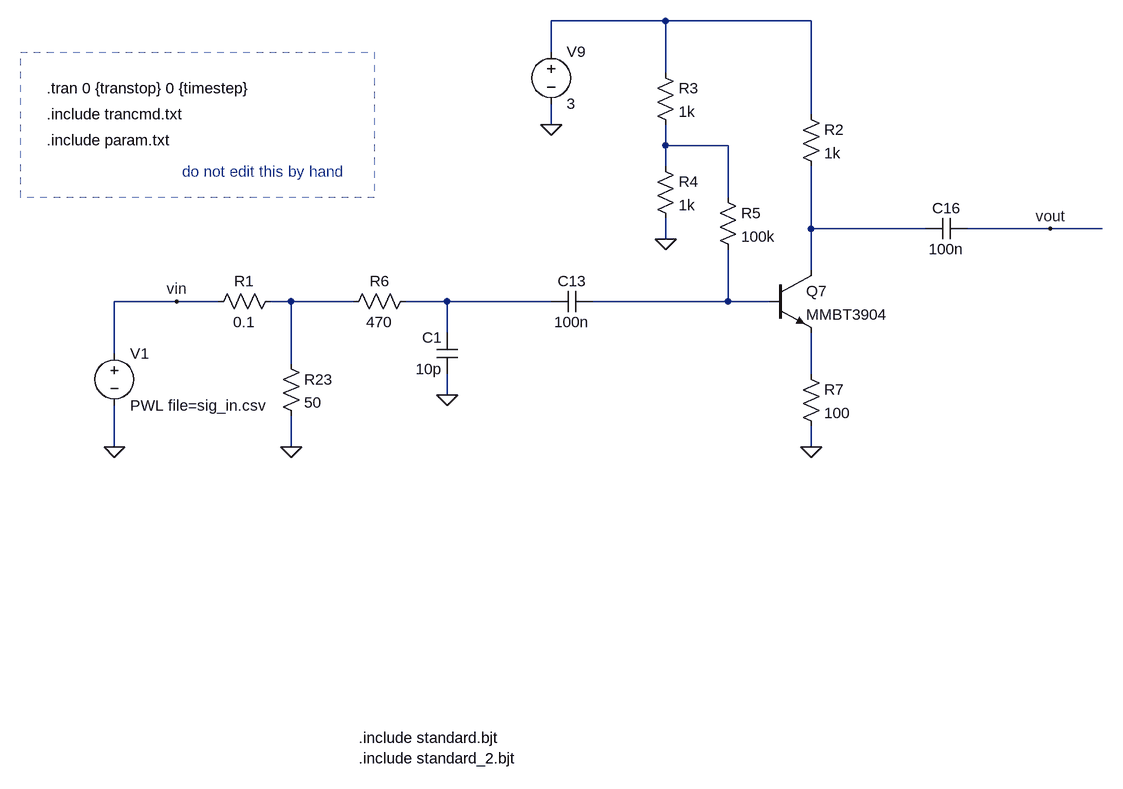
[diagram p0: schematic vca_01.asc]
vca_01.asc, the LTspice schematic file:
Version 4
SHEET 1 25452 10420
WIRE 18768 5776 18592 5776
WIRE 18992 5776 18768 5776
WIRE 18592 5824 18592 5776
WIRE 18768 5856 18768 5776
WIRE 18992 5920 18992 5776
WIRE 18592 5936 18592 5904
WIRE 18768 5968 18768 5936
WIRE 18864 5968 18768 5968
WIRE 18768 6000 18768 5968
WIRE 18864 6048 18864 5968
WIRE 18992 6096 18992 6000
WIRE 19168 6096 18992 6096
WIRE 19360 6096 19232 6096
WIRE 19440 6096 19360 6096
WIRE 18768 6112 18768 6080
WIRE 18992 6160 18992 6096
WIRE 18016 6208 17920 6208
WIRE 18080 6208 18016 6208
WIRE 18192 6208 18160 6208
WIRE 18288 6208 18192 6208
WIRE 18432 6208 18368 6208
WIRE 18592 6208 18432 6208
WIRE 18864 6208 18864 6128
WIRE 18864 6208 18656 6208
WIRE 18928 6208 18864 6208
WIRE 18432 6256 18432 6208
WIRE 17920 6288 17920 6208
WIRE 18192 6304 18192 6208
WIRE 18992 6320 18992 6256
WIRE 18432 6352 18432 6320
WIRE 17920 6432 17920 6368
WIRE 18192 6432 18192 6384
WIRE 18992 6432 18992 6400
FLAG 18192 6432 0
FLAG 18592 5936 0
FLAG 18016 6208 vin
FLAG 17920 6432 0
FLAG 19360 6096 vout
FLAG 18992 6432 0
FLAG 18768 6112 0
FLAG 18432 6352 0
SYMBOL res 18176 6288 R0
SYMATTR InstName R23
SYMATTR Value 50
SYMBOL cap 18656 6192 R90
WINDOW 0 0 32 VBottom 2
WINDOW 3 32 32 VTop 2
SYMATTR InstName C13
SYMATTR Value 100n
SYMBOL npn 18928 6160 R0
SYMATTR InstName Q7
SYMATTR Value MMBT3904
SYMBOL cap 19232 6080 R90
WINDOW 0 0 32 VBottom 2
WINDOW 3 32 32 VTop 2
SYMATTR InstName C16
SYMATTR Value 100n
SYMBOL voltage 18592 5808 R0
SYMATTR InstName V9
SYMATTR Value 3
SYMBOL voltage 17920 6272 R0
WINDOW 39 0 0 Left 0
SYMATTR InstName V1
SYMATTR Value PWL file=sig_in.csv
SYMBOL res 18176 6192 R90
WINDOW 0 0 56 VBottom 2
WINDOW 3 32 56 VTop 2
SYMATTR InstName R1
SYMATTR Value 0.1
SYMBOL res 18976 5904 R0
SYMATTR InstName R2
SYMATTR Value 1k
SYMBOL res 18752 5840 R0
SYMATTR InstName R3
SYMATTR Value 1k
SYMBOL res 18752 5984 R0
SYMATTR InstName R4
SYMATTR Value 1k
SYMBOL res 18848 6032 R0
SYMATTR InstName R5
SYMATTR Value 100k
SYMBOL res 18384 6192 R90
WINDOW 0 0 56 VBottom 2
WINDOW 3 32 56 VTop 2
SYMATTR InstName R6
SYMATTR Value 470
SYMBOL cap 18448 6320 R180
WINDOW 0 24 56 Left 2
WINDOW 3 24 8 Left 2
SYMATTR InstName C1
SYMATTR Value 10p
SYMBOL res 18976 6304 R0
SYMATTR InstName R7
SYMATTR Value 100
TEXT 18296 6880 Left 2 !.include standard.bjt\n.include standard_2.bjt
TEXT 17816 5880 Left 2 !.tran 0 {transtop} 0 {timestep}
TEXT 17816 5960 Left 2 !.include param.txt
TEXT 17816 5920 Left 2 !.include trancmd.txt
TEXT 18024 6008 Left 2 ;do not edit this by hand
RECTANGLE Normal 18320 6048 17776 5824 2

The netlist it stands for:
* vca_01.asc
R23 N004 0 50
C13 N006 N005 100n
Q7 N003 N006 N007 0 MMBT3904
C16 vout N003 100n
V9 N001 0 3
V1 vin 0 PWL file=sig_in.csv
R1 N004 vin 0.1
R2 N001 N003 1k
R3 N001 N002 1k
R4 N002 0 1k
R5 N002 N006 100k
R6 N005 N004 470
C1 0 N005 10p
R7 N007 0 100
.model NPN NPN
.model PNP PNP
.lib standard.bjt
.include standard.bjt
.include standard_2.bjt
.tran 0 {transtop} 0 {timestep}
.include param.txt
.include trancmd.txt
* do not edit this by hand
.backanno
.end